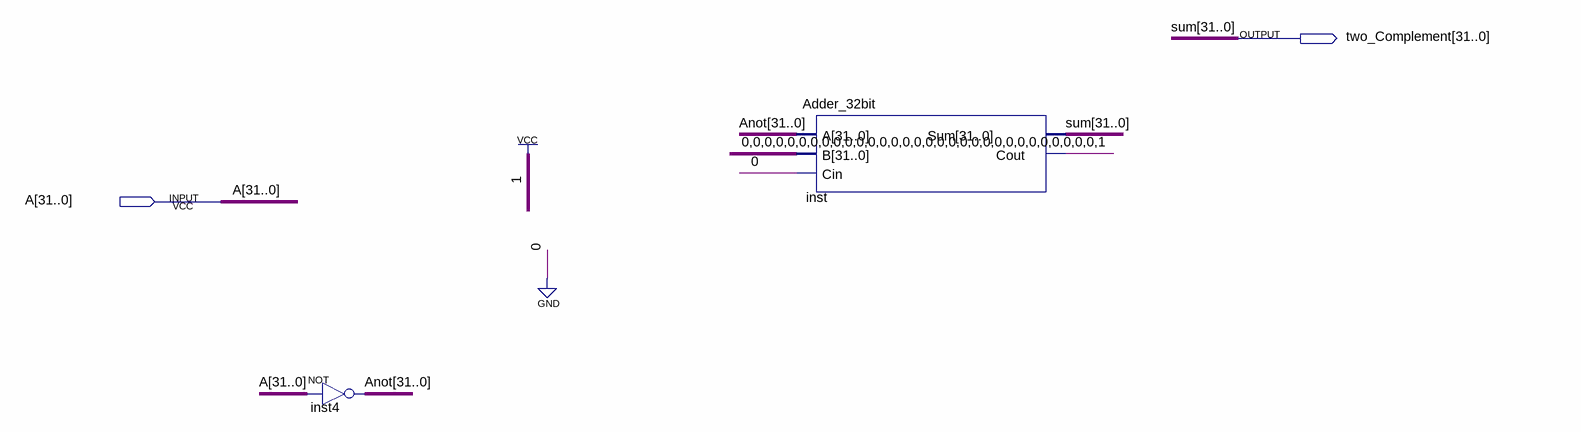
[diagram p0: schematic sheet]
// Quartus schematic tw0_complement_32bit.bdf as structural Verilog: 2 symbols, 2 pins
module tw0_complement_32bit (
  input  [31:0] A,
  output [31:0] two_Complement
);

  wire inst_cout;
  wire [31:0] Anot;

  assign Anot = ~A;  // NOT inst4, 32 bits wide
  Adder_32bit inst (
    .A(Anot), .B(32'b00000000000000000000000000000001), .Cin(1'b0), .Sum(two_Complement), .Cout(inst_cout));

  // Other names for the same wires on the sheet: sum[31:0] = two_Complement
endmodule
